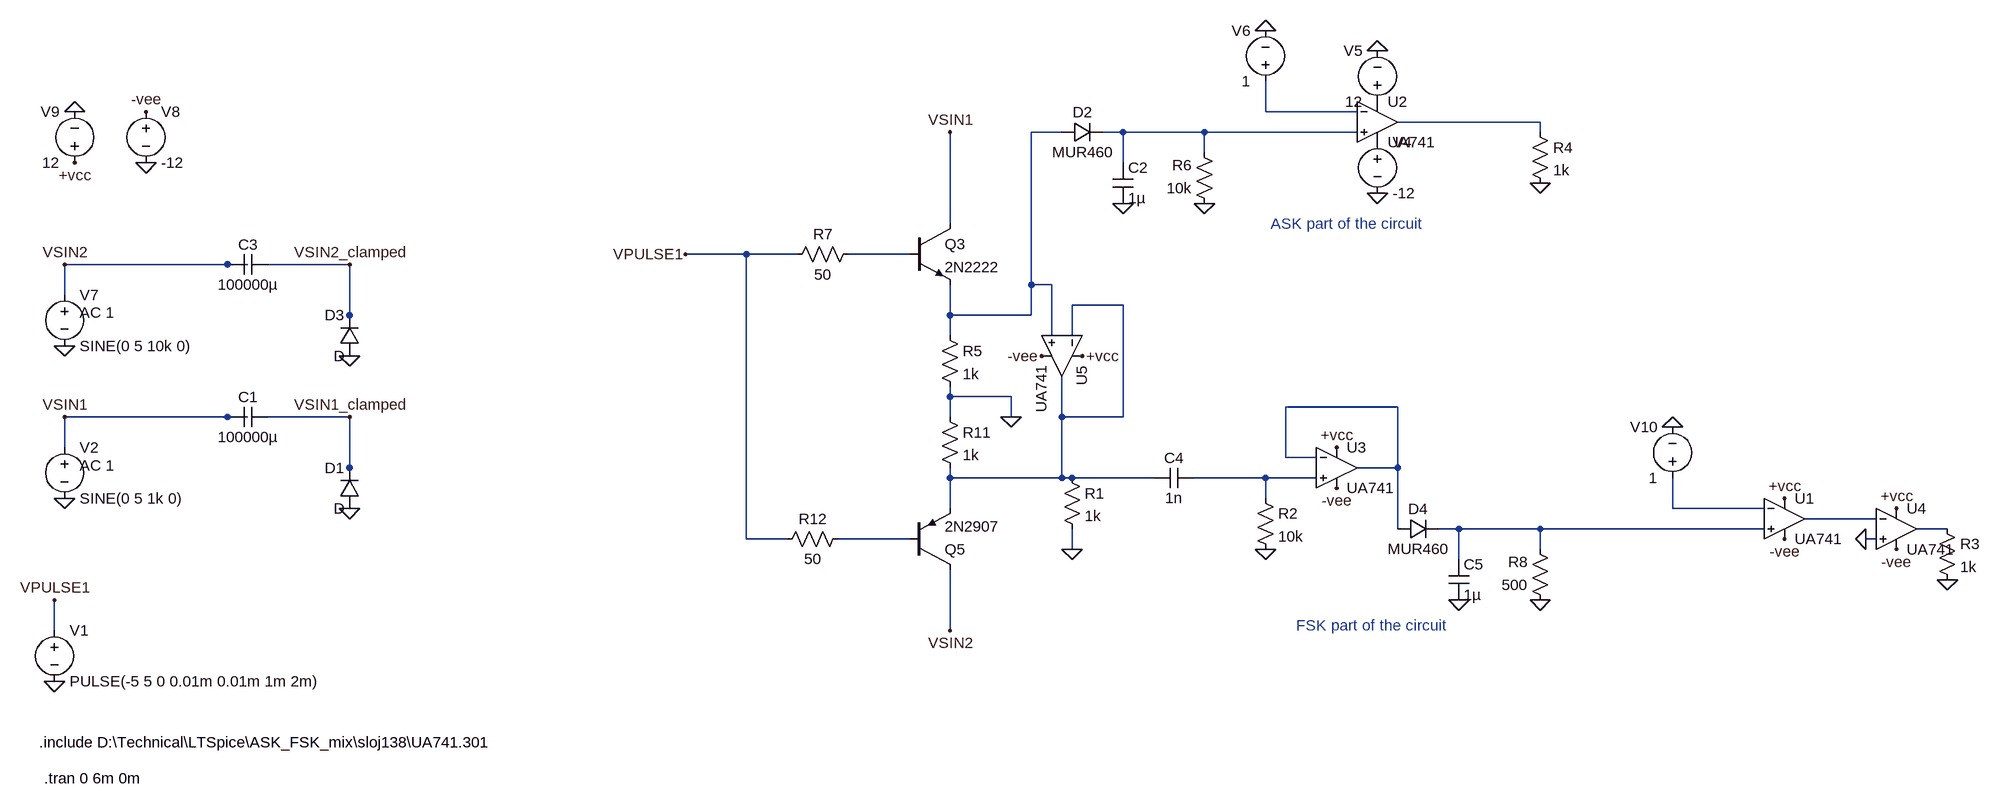
[diagram p0: schematic ASK.asc]
ASK.asc, the LTspice schematic file:
Version 4
SHEET 1 3220 1172
WIRE 1856 -64 1856 -112
WIRE 2000 -64 1856 -64
WIRE 2288 -48 2064 -48
WIRE 1536 -32 1488 -32
WIRE 1632 -32 1600 -32
WIRE 1760 -32 1632 -32
WIRE 2000 -32 1760 -32
WIRE 2288 -32 2288 -48
WIRE 1760 0 1760 -32
WIRE 1632 16 1632 -32
WIRE 1360 112 1360 -32
WIRE 1040 160 944 160
WIRE 1120 160 1040 160
WIRE 1296 160 1200 160
WIRE 224 176 -32 176
WIRE 256 176 224 176
WIRE 416 176 288 176
WIRE 1488 208 1488 -32
WIRE 1520 208 1488 208
WIRE -32 224 -32 176
WIRE 1632 240 1552 240
WIRE 416 256 416 176
WIRE 1360 256 1360 208
WIRE 1488 256 1488 208
WIRE 1488 256 1360 256
WIRE 416 272 416 256
WIRE 1360 288 1360 256
WIRE 1520 288 1520 208
WIRE 1552 288 1552 240
WIRE 1360 384 1360 368
WIRE 1456 384 1360 384
WIRE 2064 400 1888 400
WIRE 224 416 -32 416
WIRE 256 416 224 416
WIRE 416 416 288 416
WIRE 1360 416 1360 384
WIRE 1456 416 1456 384
WIRE 1536 416 1536 352
WIRE 1632 416 1632 240
WIRE 1632 416 1536 416
WIRE -32 464 -32 416
WIRE 1888 480 1888 400
WIRE 1936 480 1888 480
WIRE 416 496 416 416
WIRE 2064 496 2064 400
WIRE 2064 496 2000 496
WIRE 416 512 416 496
WIRE 1360 512 1360 496
WIRE 1536 512 1536 416
WIRE 1536 512 1360 512
WIRE 1552 512 1536 512
WIRE 1680 512 1552 512
WIRE 1856 512 1744 512
WIRE 1936 512 1856 512
WIRE 1856 544 1856 512
WIRE 1360 560 1360 512
WIRE 2496 560 2496 512
WIRE 2640 560 2496 560
WIRE 2816 576 2704 576
WIRE 2064 592 2064 496
WIRE 2160 592 2128 592
WIRE 2288 592 2160 592
WIRE 2640 592 2288 592
WIRE 2928 592 2880 592
WIRE 1040 608 1040 160
WIRE 1104 608 1040 608
WIRE 1296 608 1184 608
WIRE 2816 608 2800 608
WIRE 1552 624 1552 592
WIRE 2288 624 2288 592
WIRE 2160 640 2160 592
WIRE -48 752 -48 704
WIRE 1360 752 1360 656
FLAG -32 544 0
FLAG -48 832 0
FLAG 416 560 0
FLAG 416 416 VSIN1_clamped
FLAG -32 416 VSIN1
FLAG 1360 -32 VSIN1
FLAG -48 704 VPULSE1
FLAG 944 160 VPULSE1
FLAG 1632 80 0
FLAG 2032 -160 0
FLAG 2032 64 0
FLAG 1760 80 0
FLAG 1856 -192 0
FLAG 2288 48 0
FLAG 1360 752 VSIN2
FLAG 1456 416 0
FLAG 1552 624 0
FLAG -32 304 0
FLAG 416 320 0
FLAG 416 176 VSIN2_clamped
FLAG -32 176 VSIN2
FLAG 1856 624 0
FLAG -16 -64 0
FLAG 96 16 0
FLAG 2496 432 0
FLAG 2928 672 0
FLAG 2160 704 0
FLAG 2288 704 0
FLAG -16 16 +vcc
FLAG 96 -64 -vee
FLAG 2672 544 +vcc
FLAG 2672 608 -vee
FLAG 1968 464 +vcc
FLAG 1968 528 -vee
FLAG 2848 560 +vcc
FLAG 2848 624 -vee
FLAG 2800 608 0
FLAG 1568 320 +vcc
FLAG 1504 320 -vee
SYMBOL voltage -48 736 R0
WINDOW 123 0 0 Left 0
WINDOW 39 0 0 Left 0
SYMATTR InstName V1
SYMATTR Value PULSE(-5 5 0 0.01m 0.01m 1m 2m)
SYMBOL voltage -32 448 R0
WINDOW 123 24 44 Left 2
WINDOW 39 0 0 Left 0
SYMATTR Value2 AC 1
SYMATTR InstName V2
SYMATTR Value SINE(0 5 1k 0)
SYMBOL diode 432 560 R180
WINDOW 0 24 64 Left 2
WINDOW 3 24 0 Left 2
SYMATTR InstName D1
SYMBOL cap 288 400 R90
WINDOW 0 0 32 VBottom 2
WINDOW 3 32 32 VTop 2
SYMATTR InstName C1
SYMATTR Value 100000µ
SYMBOL npn 1296 112 R0
SYMATTR InstName Q3
SYMATTR Value 2N2222
SYMBOL res 1216 144 R90
WINDOW 0 0 56 VBottom 2
WINDOW 3 32 56 VTop 2
SYMATTR InstName R7
SYMATTR Value 50
SYMBOL res 1344 272 R0
SYMATTR InstName R5
SYMATTR Value 1k
SYMBOL diode 1536 -16 R270
WINDOW 0 32 32 VTop 2
WINDOW 3 0 32 VBottom 2
SYMATTR InstName D2
SYMATTR Value MUR460
SYMBOL res 1776 96 R180
WINDOW 0 36 76 Left 2
WINDOW 3 36 40 Left 2
SYMATTR InstName R6
SYMATTR Value 10k
SYMBOL cap 1616 16 R0
SYMATTR InstName C2
SYMATTR Value 1µ
SYMBOL voltage 2032 -32 R0
WINDOW 123 0 0 Left 0
WINDOW 39 0 0 Left 0
SYMATTR InstName V4
SYMATTR Value -12
SYMBOL voltage 2032 -64 R180
WINDOW 0 24 96 Left 2
WINDOW 3 24 16 Left 2
WINDOW 123 0 0 Left 0
WINDOW 39 0 0 Left 0
SYMATTR InstName V5
SYMATTR Value 12
SYMBOL voltage 1856 -96 R180
WINDOW 0 24 96 Left 2
WINDOW 3 24 16 Left 2
WINDOW 123 0 0 Left 0
WINDOW 39 0 0 Left 0
SYMATTR InstName V6
SYMATTR Value 1
SYMBOL res 2272 -48 R0
SYMATTR InstName R4
SYMATTR Value 1k
SYMBOL OpAmps\\opamp2 2032 -112 R0
SYMATTR InstName U2
SYMATTR Value UA741
SYMBOL res 1344 400 R0
SYMATTR InstName R11
SYMATTR Value 1k
SYMBOL res 1200 592 R90
WINDOW 0 0 56 VBottom 2
WINDOW 3 32 56 VTop 2
SYMATTR InstName R12
SYMATTR Value 50
SYMBOL pnp 1296 656 M180
SYMATTR InstName Q5
SYMATTR Value 2N2907
SYMBOL res 1536 496 R0
SYMATTR InstName R1
SYMATTR Value 1k
SYMBOL voltage -32 208 R0
WINDOW 123 24 44 Left 2
WINDOW 39 0 0 Left 0
SYMATTR Value2 AC 1
SYMATTR InstName V7
SYMATTR Value SINE(0 5 10k 0)
SYMBOL diode 432 320 R180
WINDOW 0 24 64 Left 2
WINDOW 3 24 0 Left 2
SYMATTR InstName D3
SYMBOL cap 288 160 R90
WINDOW 0 0 32 VBottom 2
WINDOW 3 32 32 VTop 2
SYMATTR InstName C3
SYMATTR Value 100000µ
SYMBOL cap 1744 496 R90
WINDOW 0 0 32 VBottom 2
WINDOW 3 32 32 VTop 2
SYMATTR InstName C4
SYMATTR Value 1n
SYMBOL res 1840 528 R0
SYMATTR InstName R2
SYMATTR Value 10k
SYMBOL voltage 96 -80 R0
WINDOW 123 0 0 Left 0
WINDOW 39 0 0 Left 0
SYMATTR InstName V8
SYMATTR Value -12
SYMBOL voltage -16 32 R180
WINDOW 0 24 96 Left 2
WINDOW 3 24 16 Left 2
WINDOW 123 0 0 Left 0
WINDOW 39 0 0 Left 0
SYMATTR InstName V9
SYMATTR Value 12
SYMBOL voltage 2496 528 R180
WINDOW 0 24 96 Left 2
WINDOW 3 24 16 Left 2
WINDOW 123 0 0 Left 0
WINDOW 39 0 0 Left 0
SYMATTR InstName V10
SYMATTR Value 1
SYMBOL res 2912 576 R0
SYMATTR InstName R3
SYMATTR Value 1k
SYMBOL OpAmps\\opamp2 2672 512 R0
SYMATTR InstName U1
SYMATTR Value UA741
SYMBOL diode 2064 608 R270
WINDOW 0 32 32 VTop 2
WINDOW 3 0 32 VBottom 2
SYMATTR InstName D4
SYMATTR Value MUR460
SYMBOL res 2304 720 R180
WINDOW 0 36 76 Left 2
WINDOW 3 36 40 Left 2
SYMATTR InstName R8
SYMATTR Value 500
SYMBOL cap 2144 640 R0
SYMATTR InstName C5
SYMATTR Value 1µ
SYMBOL OpAmps\\opamp2 1968 432 R0
SYMATTR InstName U3
SYMATTR Value UA741
SYMBOL OpAmps\\opamp2 2848 528 R0
SYMATTR InstName U4
SYMATTR Value UA741
SYMBOL OpAmps\\opamp2 1600 320 R90
SYMATTR InstName U5
SYMATTR Value UA741
TEXT -64 984 Left 2 !.tran 0 6m 0m
TEXT -72 928 Left 2 !.include D:\\Technical\\LTSpice\\ASK_FSK_mix\\sloj138\\UA741.301
TEXT 1864 112 Left 2 ;ASK part of the circuit
TEXT 1904 744 Left 2 ;FSK part of the circuit

The netlist it stands for:
* ASK.asc
V1 VPULSE1 0 PULSE(-5 5 0 0.01m 0.01m 1m 2m)
V2 VSIN1 0 SINE(0 5 1k 0) AC 1
D1 0 VSIN1_clamped D
C1 VSIN1_clamped VSIN1 100000µ
Q3 VSIN1 N005 N003 0 2N2222
R7 N005 VPULSE1 50
R5 N003 0 1k
D2 N003 N004 MUR460
R6 0 N004 10k
C2 N004 0 1µ
V4 P001 0 -12
V5 P002 0 12
V6 N001 0 1
R4 N002 0 1k
XU2 N004 N001 P002 P001 N002 UA741  ; pins In+ In- V+ V- OUT
R11 0 N006 1k
R12 N013 VPULSE1 50
Q5 VSIN2 N013 N006 0 2N2907
R1 N006 0 1k
V7 VSIN2 0 SINE(0 5 10k 0) AC 1
D3 0 VSIN2_clamped D
C3 VSIN2_clamped VSIN2 100000µ
C4 N008 N006 1n
R2 N008 0 10k
V8 -vee 0 -12
V9 +vcc 0 12
V10 N009 0 1
R3 N012 0 1k
XU1 N011 N009 +vcc -vee N010 UA741  ; pins In+ In- V+ V- OUT
D4 N007 N011 MUR460
R8 0 N011 500
C5 N011 0 1µ
XU3 N008 N007 +vcc -vee N007 UA741  ; pins In+ In- V+ V- OUT
XU4 0 N010 +vcc -vee N012 UA741  ; pins In+ In- V+ V- OUT
XU5 N003 N006 +vcc -vee N006 UA741  ; pins In+ In- V+ V- OUT
.model D D
.lib standard.dio
.model NPN NPN
.model PNP PNP
.lib standard.bjt
.tran 0 6m 0m
.include D:\Technical\LTSpice\ASK_FSK_mix\sloj138\UA741.301
* ASK part of the circuit
* FSK part of the circuit
.backanno
.end